# EAGLE design preparedinstruments_0_bechemel_v12_KEYPAD_JLC_READY (EAGLE 9.6.2)

## Sheet 1 of 2
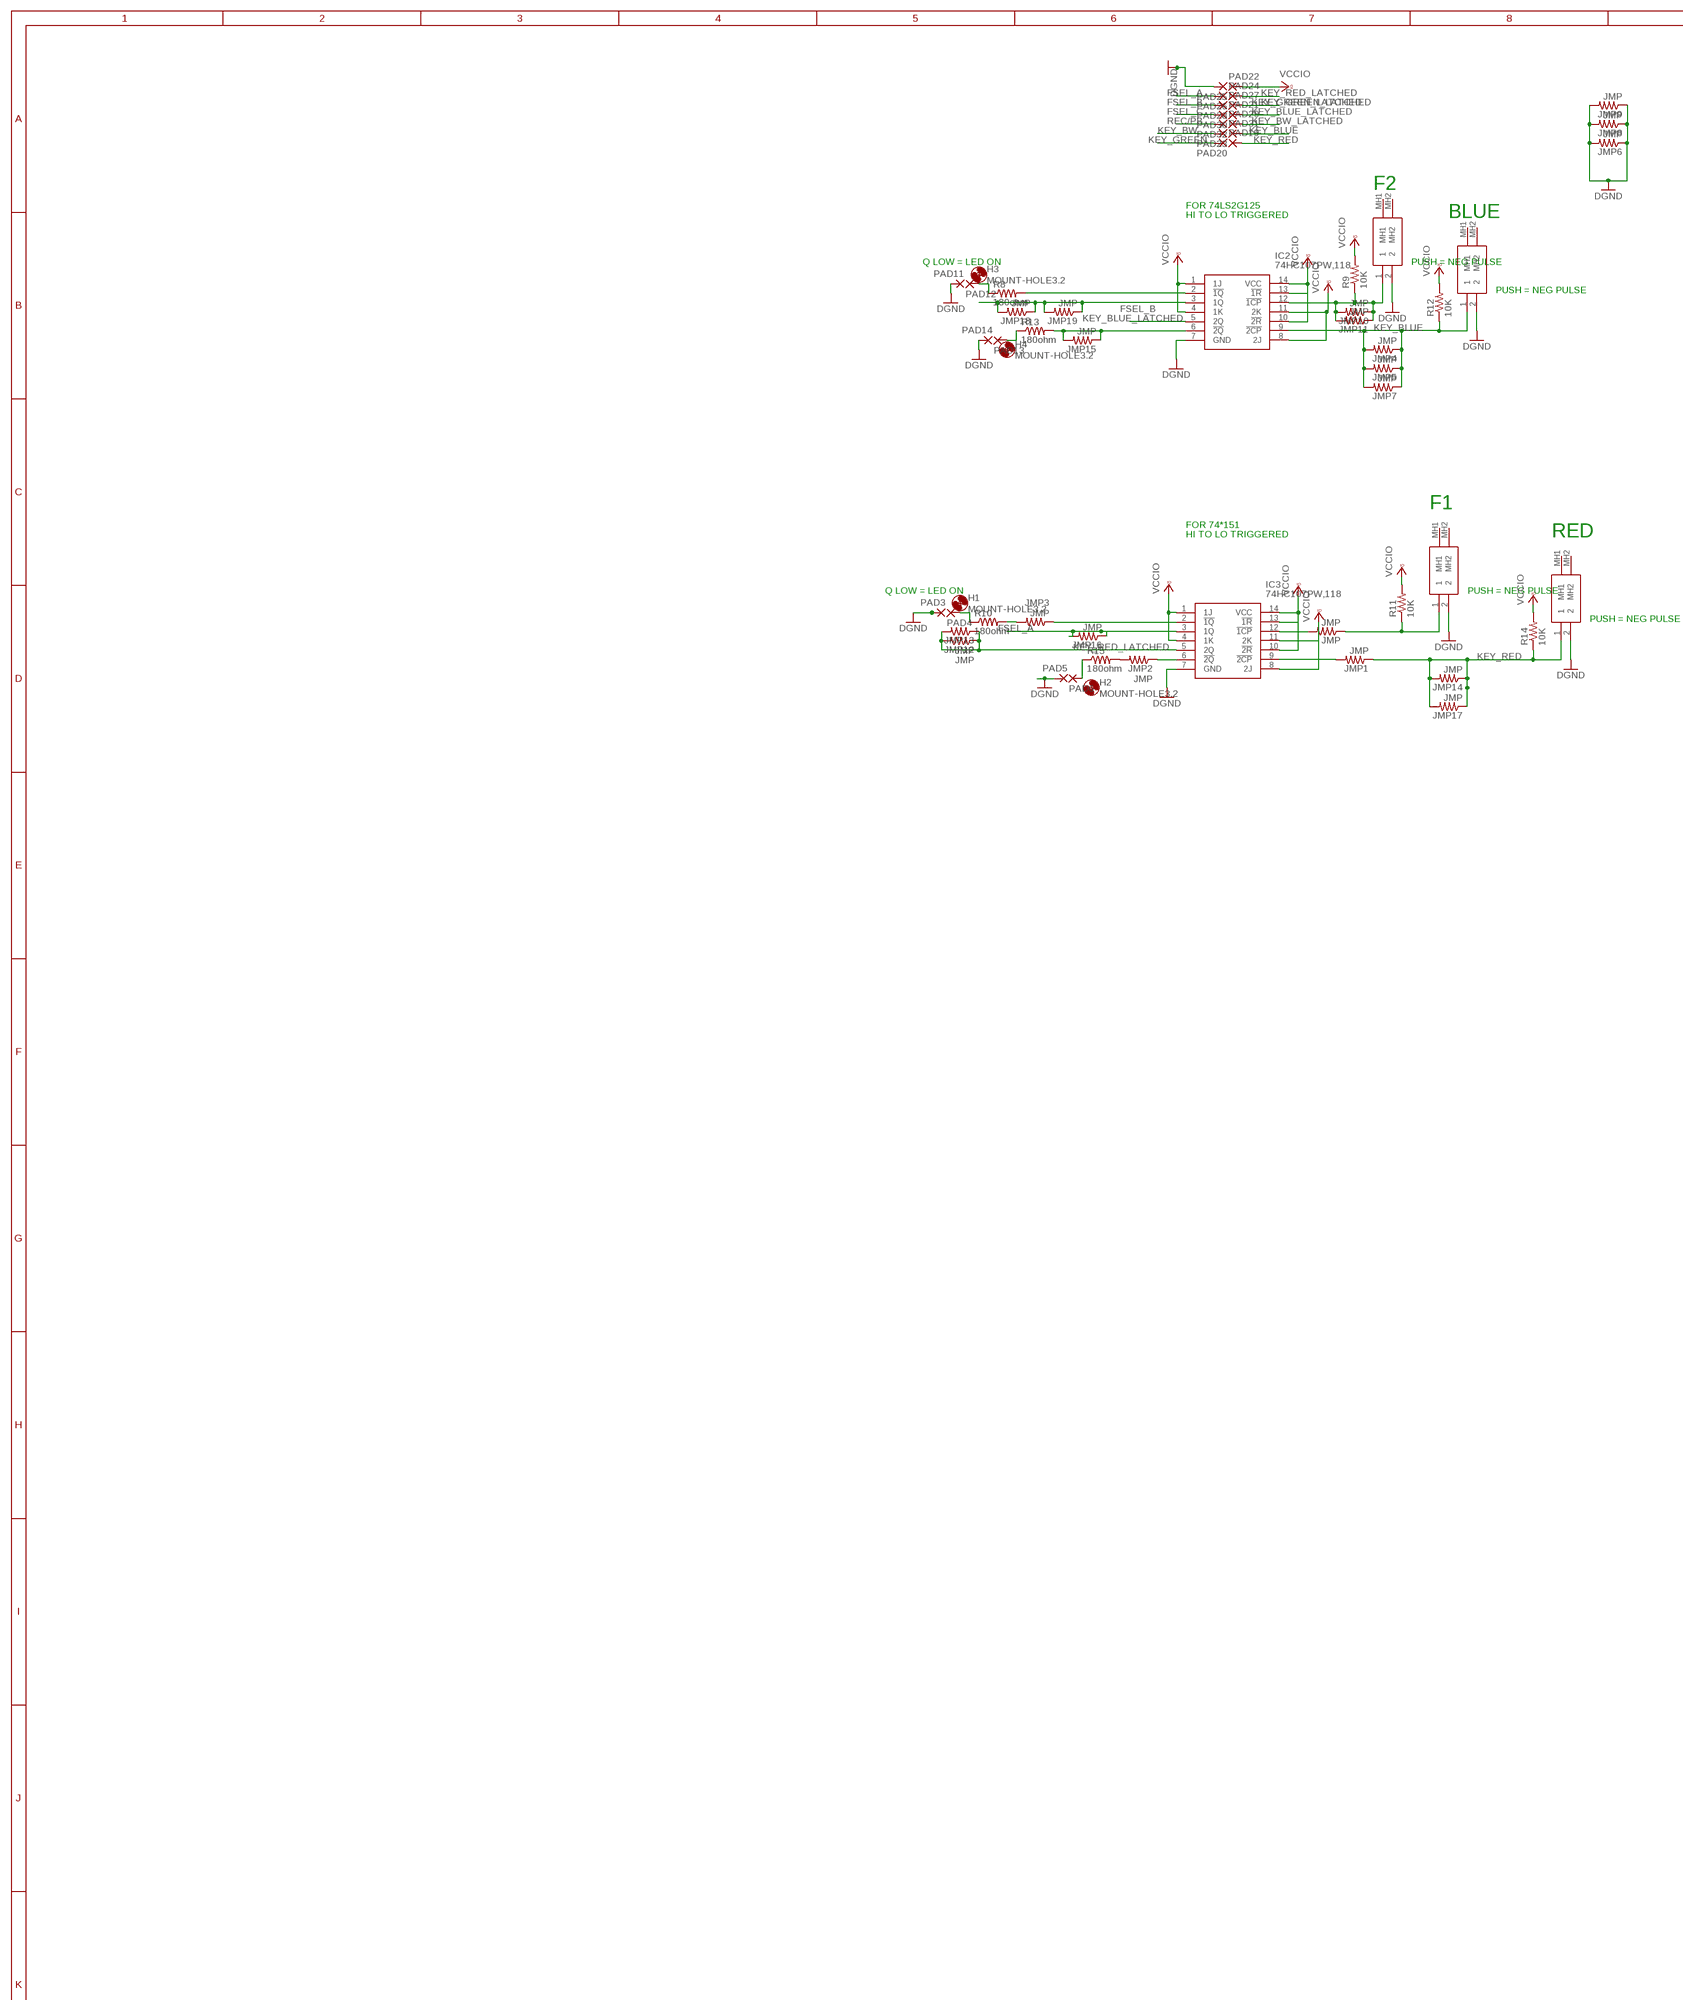
[diagram p0: schematic, sheet 1, part 1 of 3]
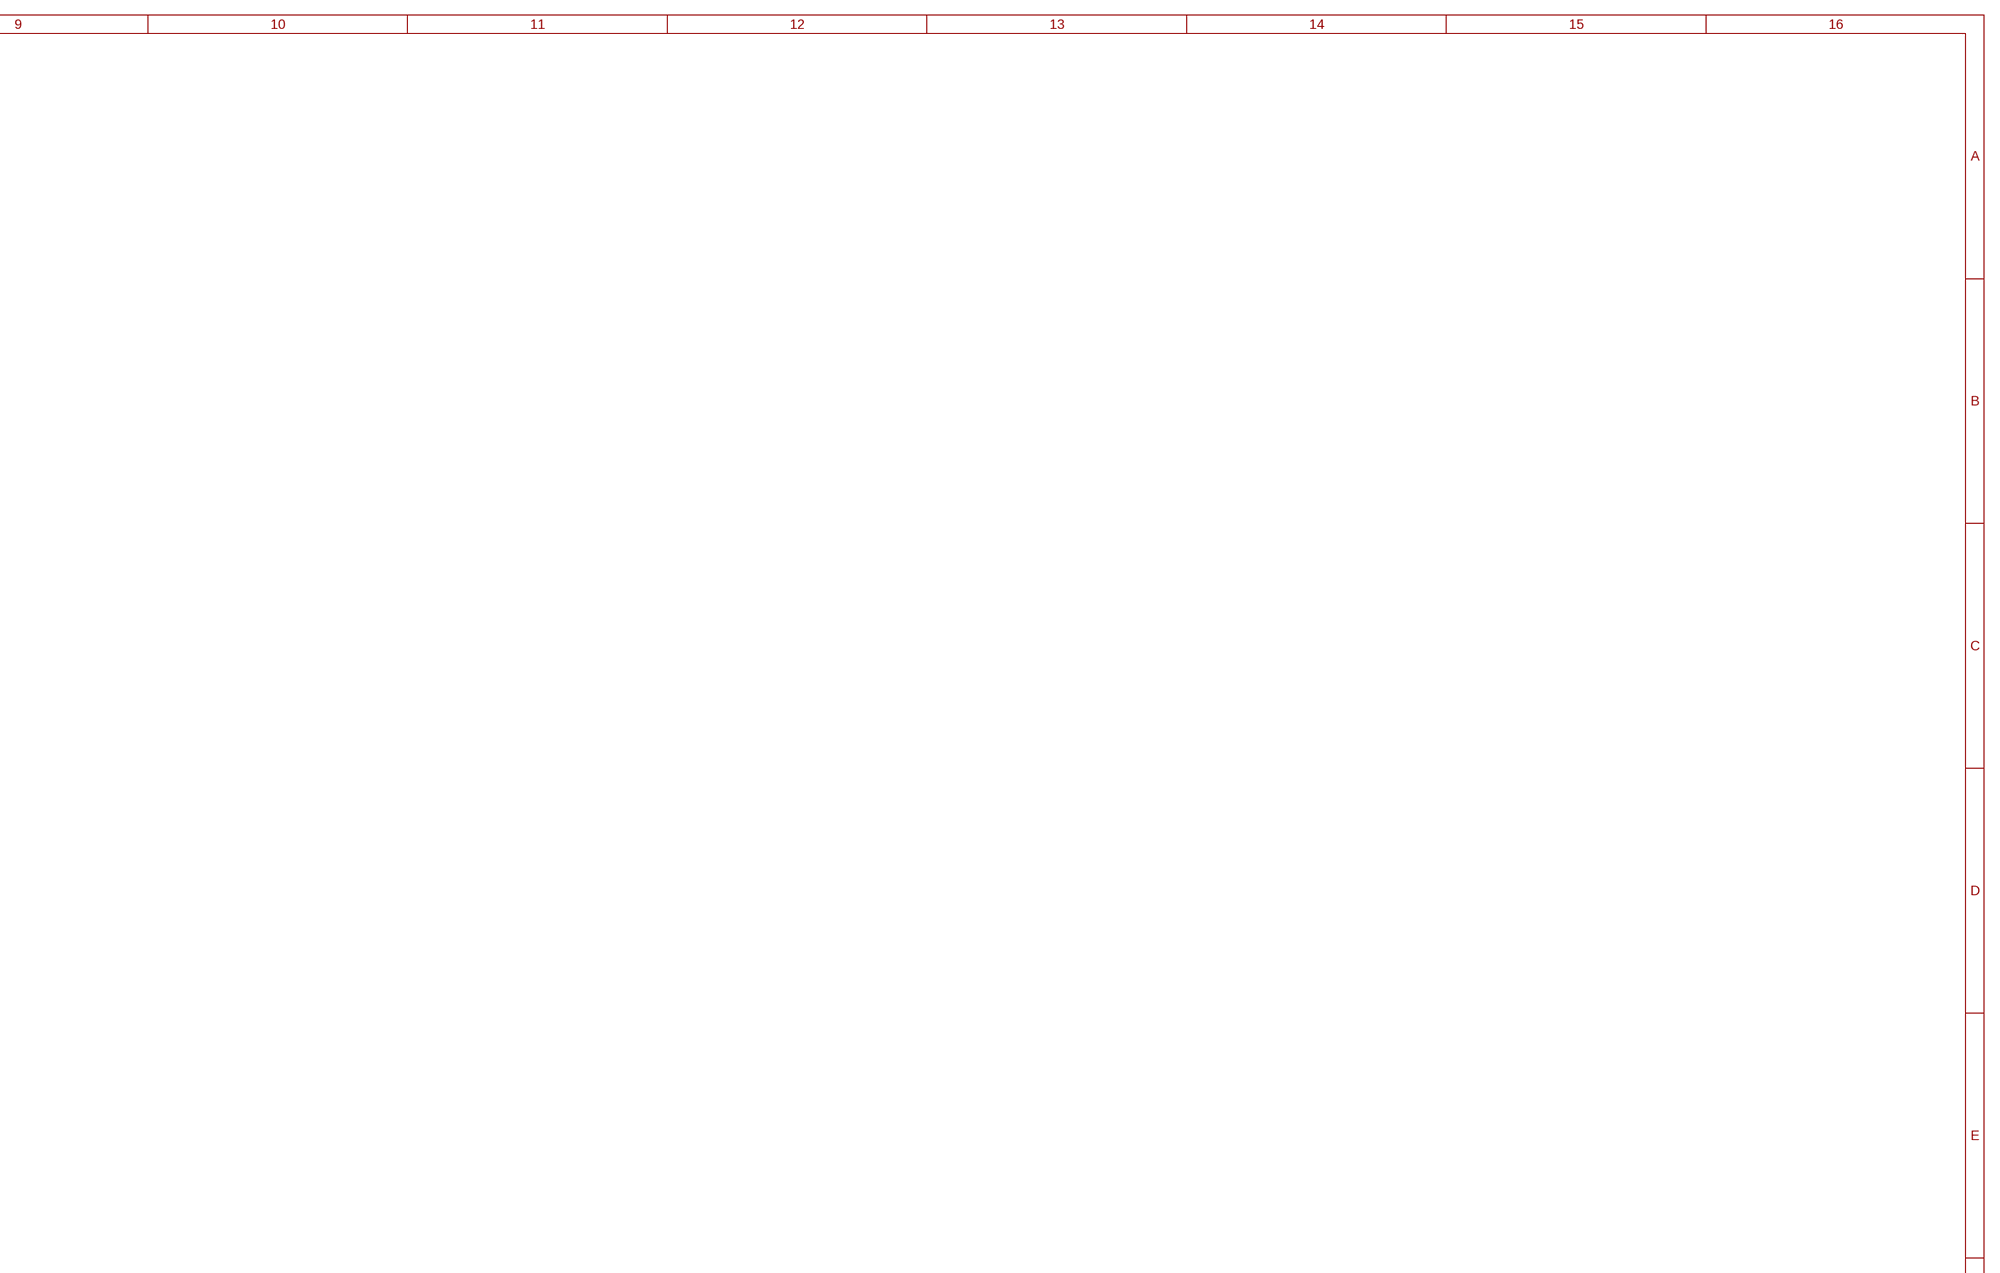
[diagram p1: schematic, sheet 1, part 2 of 3]
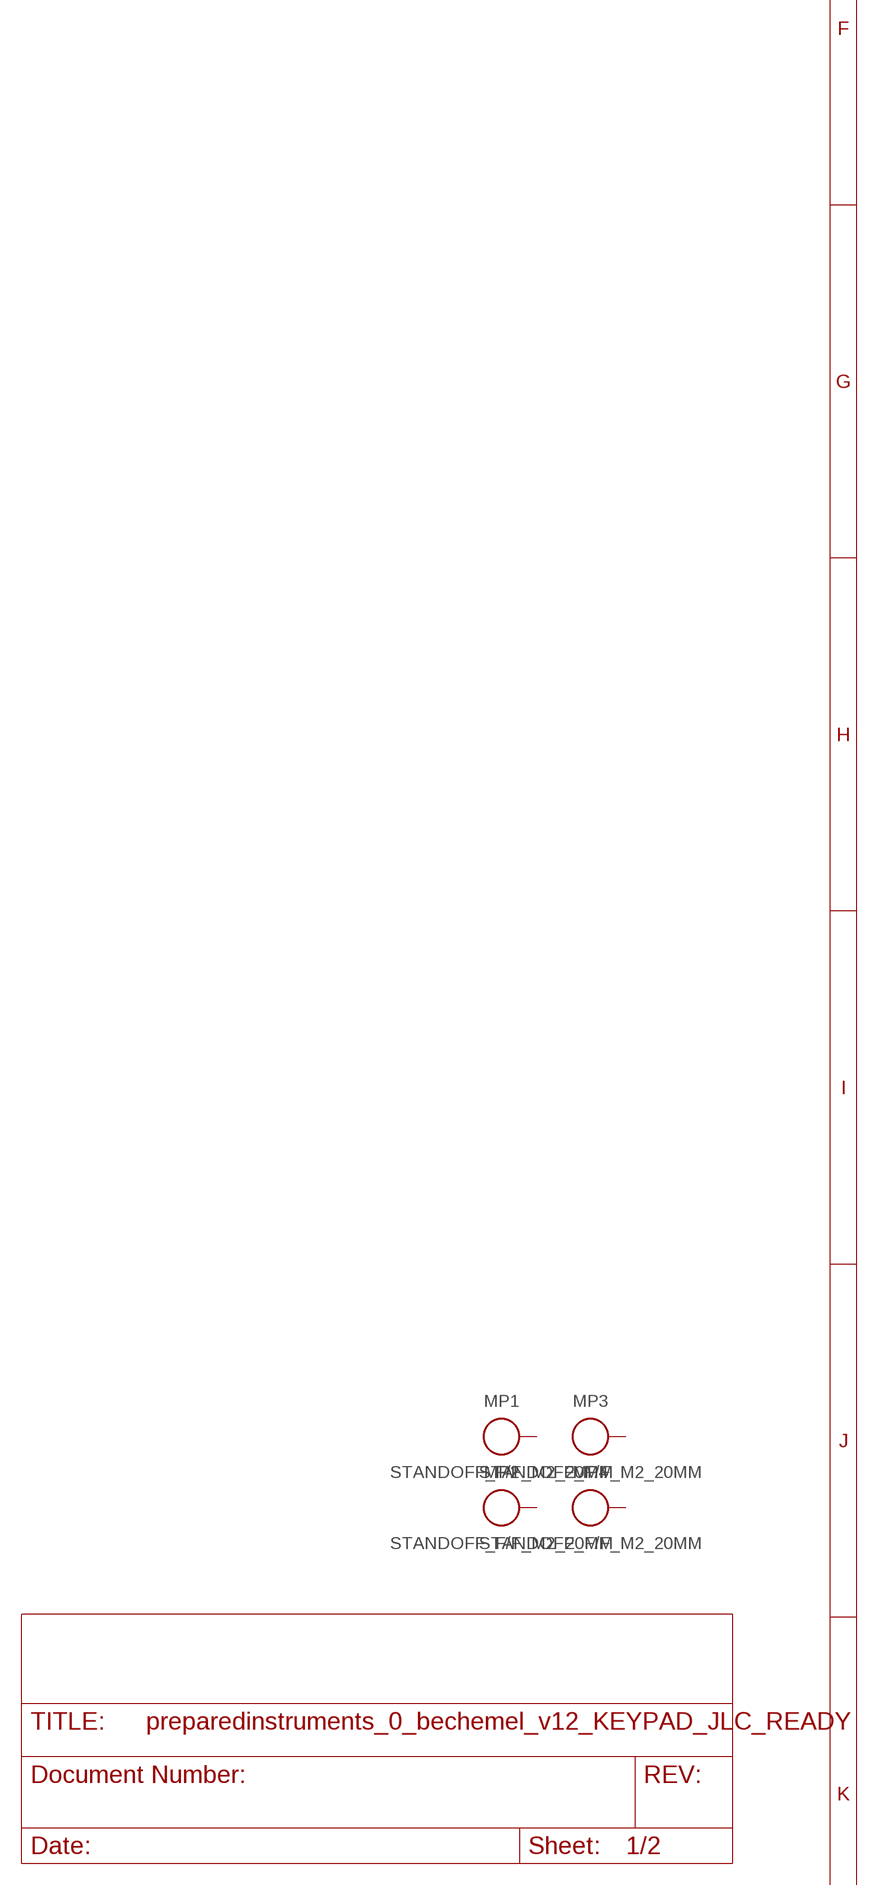
[diagram p2: schematic, sheet 1, part 3 of 3]

### Parts
H1  MOUNT-HOLE3.2  [3,2]
H2  MOUNT-HOLE3.2  [3,2]
H3  MOUNT-HOLE3.2  [3,2]
H4  MOUNT-HOLE3.2  [3,2]
IC2  74HC107PW,118  [SOP65P640X110-14N]
IC3  74HC107PW,118  [SOP65P640X110-14N]
JMP  JMP  R-US_R0805  [R0805]
JMP1  JMP  R-US_R0805  [R0805]
JMP2  JMP  R-US_R0805  [R0805]
JMP3  JMP  R-US_R0805  [R0805]
JMP4  JMP  R-US_R0805  [R0805]
JMP5  JMP  R-US_R0805  [R0805]
JMP6  JMP  R-US_R0805  [R0805]
JMP7  JMP  R-US_R0805  [R0805]
JMP8  JMP  R-US_R0805  [R0805]
JMP9  JMP  R-US_R0805  [R0805]
JMP10  JMP  R-US_R0805  [R0805]
JMP11  JMP  R-US_R0805  [R0805]
JMP12  JMP  R-US_R0805  [R0805]
JMP13  JMP  R-US_R0805  [R0805]
JMP14  JMP  R-US_R0805  [R0805]
JMP15  JMP  R-US_R0805  [R0805]
JMP16  JMP  R-US_R0805  [R0805]
JMP17  JMP  R-US_R0805  [R0805]
JMP18  JMP  R-US_R0805  [R0805]
JMP19  JMP  R-US_R0805  [R0805]
MP1  STANDOFF_F/F_M2_20MM  [STANDOFF_HEX_FEMALE_400X2000_M2X0.4_MTGP600H220]
MP2  STANDOFF_F/F_M2_20MM  [STANDOFF_HEX_FEMALE_400X2000_M2X0.4_MTGP600H220]
MP3  STANDOFF_F/F_M2_20MM  [STANDOFF_HEX_FEMALE_400X2000_M2X0.4_MTGP600H220]
MP4  STANDOFF_F/F_M2_20MM  [STANDOFF_HEX_FEMALE_400X2000_M2X0.4_MTGP600H220]
PAD3  SMD2  [SMD1,27-2,54]
PAD4  SMD2  [SMD1,27-2,54]
PAD5  SMD2  [SMD1,27-2,54]
PAD6  SMD2  [SMD1,27-2,54]
PAD11  SMD2  [SMD1,27-2,54]
PAD12  SMD2  [SMD1,27-2,54]
PAD13  SMD2  [SMD1,27-2,54]
PAD14  SMD2  [SMD1,27-2,54]
PAD19  SMD2  [SMD1,27-2,54]
PAD20  SMD2  [SMD1,27-2,54]
PAD21  SMD2  [SMD1,27-2,54]
PAD22  SMD2  [SMD1,27-2,54]
PAD23  SMD2  [SMD1,27-2,54]
PAD24  SMD2  [SMD1,27-2,54]
PAD25  SMD2  [SMD1,27-2,54]
PAD26  SMD2  [SMD1,27-2,54]
PAD27  SMD2  [SMD1,27-2,54]
PAD28  SMD2  [SMD1,27-2,54]
PAD29  SMD2  [SMD1,27-2,54]
PAD30  SMD2  [SMD1,27-2,54]
PAD31  SMD2  [SMD1,27-2,54]
PAD32  SMD2  [SMD1,27-2,54]
R8  180ohm  R-US_R0805  [R0805]
R9  10K  R-US_R0805  [R0805]
R10  180ohm  R-US_R0805  [R0805]
R11  10K  R-US_R0805  [R0805]
R12  10K  R-US_R0805  [R0805]
R13  180ohm  R-US_R0805  [R0805]
R14  10K  R-US_R0805  [R0805]
R15  180ohm  R-US_R0805  [R0805]
S6  MX1A-11NW  [MX1A11NW]
S7  MX1A-11NW  [MX1A11NW]
S8  MX1A-11NW  [MX1A11NW]
S9  MX1A-11NW  [MX1A11NW]

### Nets
DGND: IC2.7(GND) IC3.7(GND) JMP6.1 JMP6.2 JMP8.1 JMP8.2 JMP9.1 JMP9.2 PAD3.1(P) PAD5.1(P) PAD11.1(P) PAD14.1(P) PAD25.1(P) S6.2 S7.2 S8.2 S9.2 ; also sheet 2
FSEL_A: IC3.3(1Q) JMP16.1 JMP16.2 PAD26.1(P)
FSEL_B: IC2.3(1Q) JMP18.1 JMP18.2 JMP19.1 JMP19.2 PAD28.1(P)
FSEL_C: PAD30.1(P) ; also sheet 2
KEY_BLUE: IC2.9(!2CP) JMP4.1 JMP4.2 JMP5.1 JMP5.2 JMP7.1 JMP7.2 PAD31.1(P) R12.1 S8.1
KEY_BLUE_LATCHED: IC2.5(2Q) PAD21.1(P)
KEY_BW: PAD23.1(P) ; also sheet 2
KEY_BW_LATCHED: PAD29.1(P) ; also sheet 2
KEY_GREEN: PAD20.1(P) ; also sheet 2
KEY_GREEN_LATCHED: PAD27.1(P) ; also sheet 2
KEY_RED: JMP1.1 JMP14.1 JMP14.2 JMP17.1 JMP17.2 PAD19.1(P) R14.1 S9.1
KEY_RED_LATCHED: IC3.5(2Q) JMP12.1 JMP12.2 JMP13.1 JMP13.2 PAD24.1(P)
N$13: PAD12.1(P) R8.1
N$14: IC2.2(!1Q) R8.2
N$16: IC2.12(!1CP) JMP10.1 JMP10.2 JMP11.1 JMP11.2 R9.1 S6.1
N$17: PAD4.1(P) R10.1
N$18: JMP3.2 R10.2
N$20: IC3.12(!1CP) JMP.2
N$22: PAD13.1(P) R13.1
N$23: IC2.6(!2Q) JMP15.1 JMP15.2 R13.2
N$26: PAD6.1(P) R15.1
N$27: JMP2.2 R15.2
N$33: JMP.1 R11.1 S7.1
N$35: IC3.9(!2CP) JMP1.2
N$36: IC3.6(!2Q) JMP2.1
N$37: IC3.2(!1Q) JMP3.1
REC/PB: PAD32.1(P) ; also sheet 2
VCCIO: IC2.1(1J) IC2.4(1K) IC2.8(2J) IC2.10(!2R) IC2.11(2K) IC2.13(!1R) IC2.14(VCC) IC3.1(1J) IC3.4(1K) IC3.8(2J) IC3.10(!2R) IC3.11(2K) IC3.13(!1R) IC3.14(VCC) PAD22.1(P) R9.2 R11.2 R12.2 R14.2 ; also sheet 2
Unconnected: MP1.1 MP2.1 MP3.1 MP4.1 S6.MH1 S6.MH2 S7.MH1 S7.MH2 S8.MH1 S8.MH2 S9.MH1 S9.MH2

### Notes on the sheet
- F2
- FOR 74LS2G125
- HI TO LO TRIGGERED | BLUE
- Q LOW = LED ON | PUSH = NEG PULSE
- PUSH = NEG PULSE
- F1
- FOR 74*151
- HI TO LO TRIGGERED | RED
- Q LOW = LED ON | PUSH = NEG PULSE
- PUSH = NEG PULSE

## Sheet 2 of 2
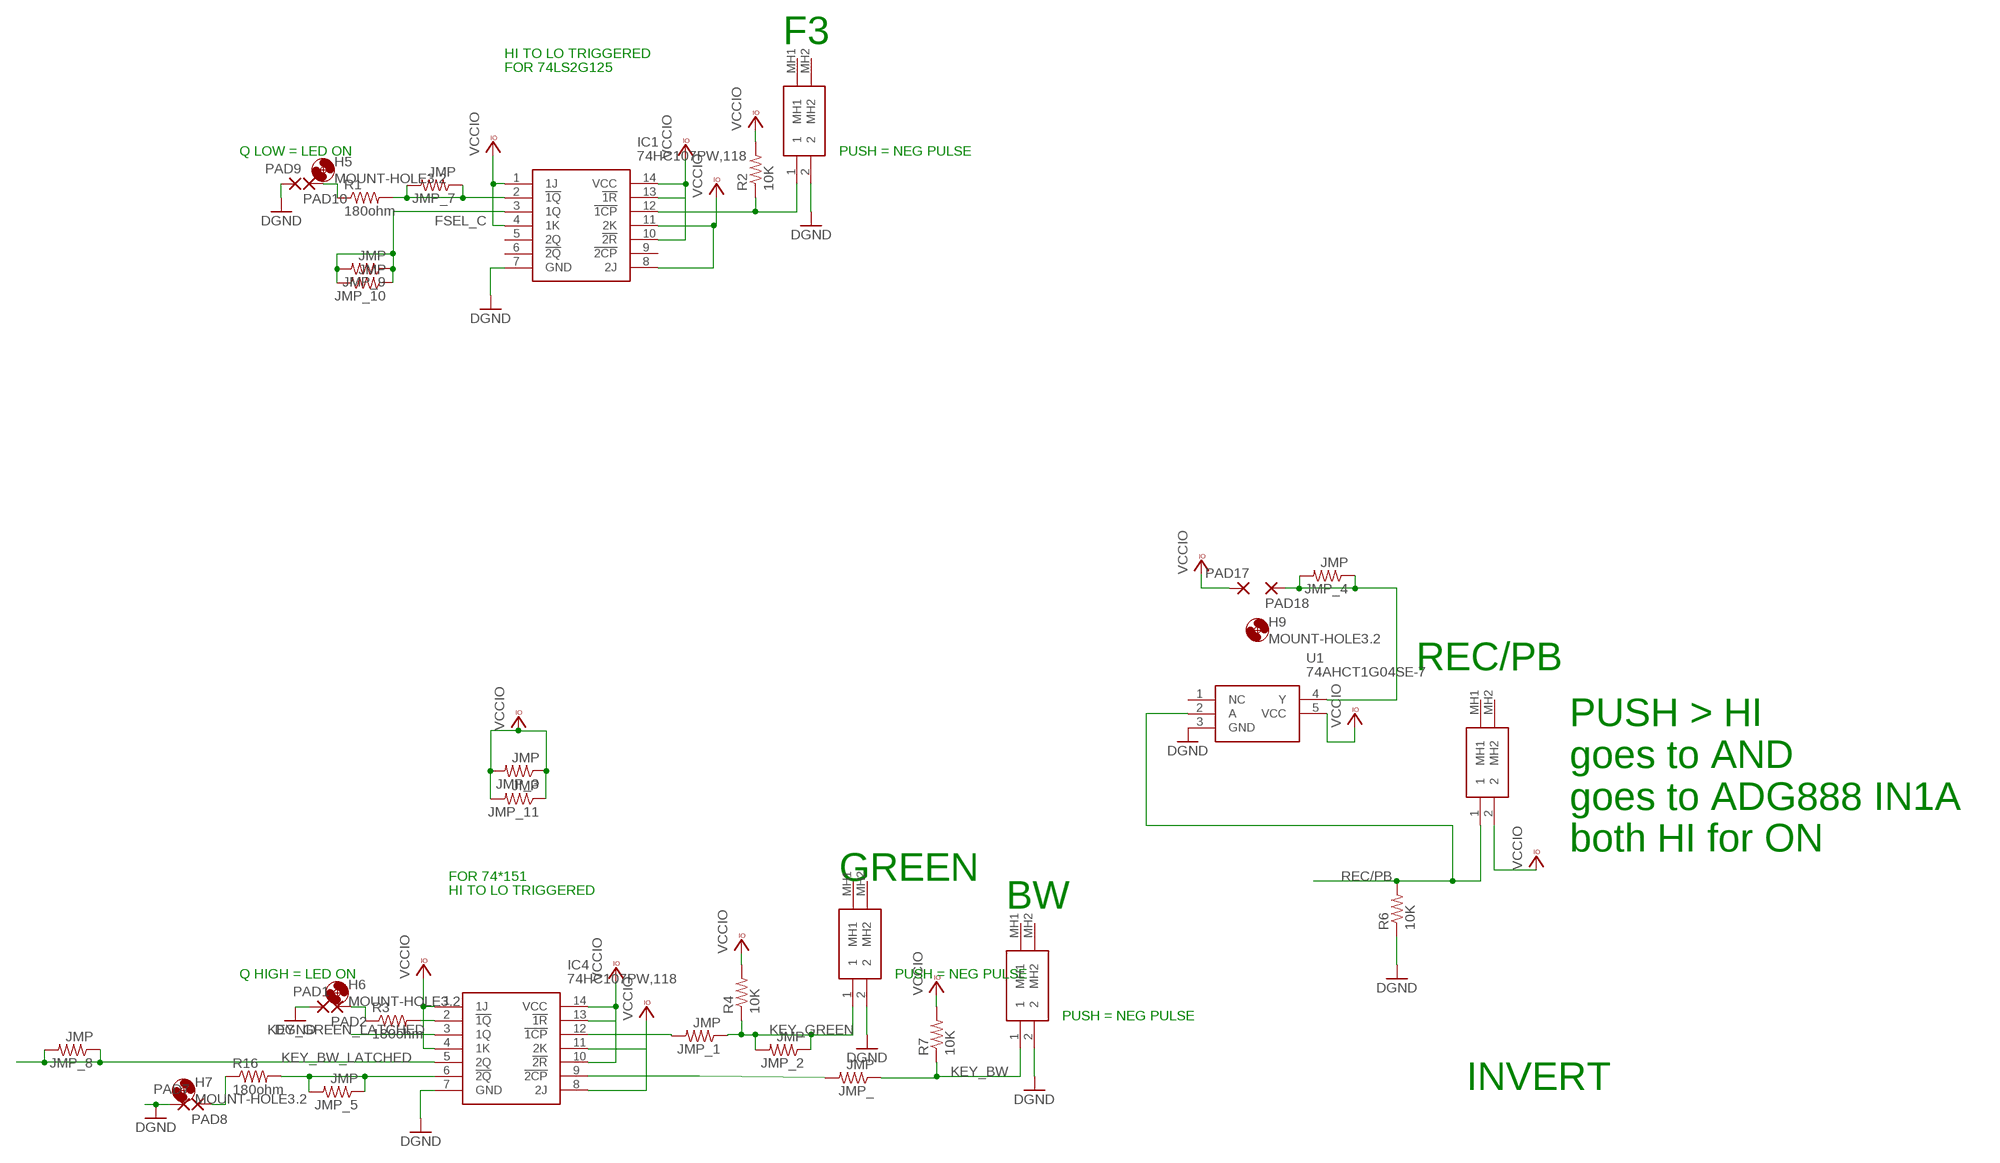
[diagram p3: schematic, sheet 2]

### Parts
H5  MOUNT-HOLE3.2  [3,2]
H6  MOUNT-HOLE3.2  [3,2]
H7  MOUNT-HOLE3.2  [3,2]
H9  MOUNT-HOLE3.2  [3,2]
IC1  74HC107PW,118  [SOP65P640X110-14N]
IC4  74HC107PW,118  [SOP65P640X110-14N]
JMP_  JMP  R-US_R0805  [R0805]
JMP_1  JMP  R-US_R0805  [R0805]
JMP_2  JMP  R-US_R0805  [R0805]
JMP_3  JMP  R-US_R0805  [R0805]
JMP_4  JMP  R-US_R0805  [R0805]
JMP_5  JMP  R-US_R0805  [R0805]
JMP_7  JMP  R-US_R0805  [R0805]
JMP_8  JMP  R-US_R0805  [R0805]
JMP_9  JMP  R-US_R0805  [R0805]
JMP_10  JMP  R-US_R0805  [R0805]
JMP_11  JMP  R-US_R0805  [R0805]
PAD1  SMD2  [SMD1,27-2,54]
PAD2  SMD2  [SMD1,27-2,54]
PAD7  SMD2  [SMD1,27-2,54]
PAD8  SMD2  [SMD1,27-2,54]
PAD9  SMD2  [SMD1,27-2,54]
PAD10  SMD2  [SMD1,27-2,54]
PAD17  SMD2  [SMD1,27-2,54]
PAD18  SMD2  [SMD1,27-2,54]
R1  180ohm  R-US_R0805  [R0805]
R2  10K  R-US_R0805  [R0805]
R3  180ohm  R-US_R0805  [R0805]
R4  10K  R-US_R0805  [R0805]
R6  10K  R-US_R0805  [R0805]
R7  10K  R-US_R0805  [R0805]
R16  180ohm  R-US_R0805  [R0805]
S1  MX1A-11NW  [MX1A11NW]
S2  MX1A-11NW  [MX1A11NW]
S4  MX1A-11NW  [MX1A11NW]
S5  MX1A-11NW  [MX1A11NW]
U1  74AHCT1G04SE-7  [SOT65P210X110-5N]

### Nets
DGND: IC1.7(GND) IC4.7(GND) PAD1.1(P) PAD7.1(P) PAD9.1(P) R6.1 S1.2 S2.2 S4.2 U1.3(GND) ; also sheet 1
FSEL_C: IC1.3(1Q) JMP_9.1 JMP_9.2 JMP_10.1 JMP_10.2 ; also sheet 1
KEY_BW: JMP_.1 R7.1 S4.1 ; also sheet 1
KEY_BW_LATCHED: IC4.5(2Q) JMP_8.1 JMP_8.2 ; also sheet 1
KEY_GREEN: JMP_1.1 JMP_2.1 JMP_2.2 R4.1 S2.1 ; also sheet 1
KEY_GREEN_LATCHED: IC4.3(1Q) ; also sheet 1
N$1: PAD10.1(P) R1.1
N$2: IC1.2(!1Q) JMP_7.1 JMP_7.2 R1.2
N$3: JMP_4.1 JMP_4.2 PAD18.1(P) U1.4(Y)
N$4: IC1.12(!1CP) R2.1 S1.1
N$5: PAD2.1(P) R3.1
N$6: IC4.2(!1Q) R3.2
N$30: PAD8.1(P) R16.1
N$31: IC4.6(!2Q) JMP_5.1 JMP_5.2 R16.2
N$34: IC4.9(!2CP) JMP_.2
N$39: IC4.12(!1CP) JMP_1.2
REC/PB: R6.2 S5.1 U1.2(A) ; also sheet 1
VCCIO: IC1.1(1J) IC1.4(1K) IC1.8(2J) IC1.10(!2R) IC1.11(2K) IC1.13(!1R) IC1.14(VCC) IC4.1(1J) IC4.4(1K) IC4.8(2J) IC4.10(!2R) IC4.11(2K) IC4.13(!1R) IC4.14(VCC) JMP_3.1 JMP_3.2 JMP_11.1 JMP_11.2 PAD17.1(P) R2.2 R4.2 R7.2 S5.2 U1.5(VCC) ; also sheet 1
Unconnected: IC1.5(2Q) IC1.6(!2Q) IC1.9(!2CP) S1.MH1 S1.MH2 S2.MH1 S2.MH2 S4.MH1 S4.MH2 S5.MH1 S5.MH2 U1.1(NC)

### Notes on the sheet
- F3
- HI TO LO TRIGGERED
- FOR 74LS2G125
- Q LOW = LED ON | PUSH = NEG PULSE
- REC/PB
- PUSH > HI
  goes to AND 
  goes to ADG888 IN1A
  both HI for ON
- FOR 74*151 | GREEN
- HI TO LO TRIGGERED
- BW
- Q HIGH = LED ON | PUSH = NEG PULSE
- PUSH = NEG PULSE
- INVERT

## Library data of the parts
H1-H7 H9 = holes:MOUNT-HOLE: MOUNTING HOLE with drill center marker
IC1-IC4 = 74HC107PW_118:74HC107PW,118: 74HC(T)107 - Dual JK flip-flop with reset; negative-edge trigger@en-us Source: Datasheet <https://assets.nexperia.com/documents/data-sheet/74HC_HCT107.pdf>; DESCRIPTION: 74HC(T)107 - Dual JK flip-flop with reset; negative-edge trigger@en-us; HEIGHT: 1.1mm; MANUFACTURER_NAME: Nexperia; MANUFACTURER_PART_NUMBER: 74HC107PW,118; MOUSER_PART_NUMBER: 771-HC107PW118; MOUSER_PRICE-STOCK: https://www.mouser.co.uk/ProductDetail/Nexperia/74HC107PW118?qs=P62ublwmbi8k2l1WkAc68Q%3D%3D
JMP JMP1-JMP19 JMP_ JMP_1-JMP_5 JMP_7-JMP_11 R1-R4 R6-R16 = adafruit:R-US_: RESISTOR, American symbol
MP1-MP4 = PCB-Fasteners_Hardware:STANDOFF_F/F: Female-Female Standoff/Spacer with Mounting pad and hole. Essentra : Female Standoff <https://www.essentracomponents.co.in/index.php?option=com_virtuemart&view=productdetails&virtuemart_product_id=14493> The hole and pad sizes may vary based on the application and type of hardware; always verify the Manufacturer specification or Global Standards.; CATEGORY: Standoff/Spacer; SUB-CATEGORY: Female-Female
PAD1-PAD14 PAD17-PAD32 = wirepad:SMD2: SMD PAD
S1 S2 S4-S9 = MX1A-11NW:MX1A-11NW: CHERRY - MX1A-11NW - Tactile Switch, MX Series, Top Actuated, Surface Mount, Plunger for Cap, 59.5 gf, 10mA at 12VDC Source: Datasheet <https://media.digikey.com/pdf/Data Sheets/Cherry PDFs/MX Series.pdf>; DESCRIPTION: CHERRY - MX1A-11NW - Tactile Switch, MX Series, Top Actuated, Surface Mount, Plunger for Cap, 59.5 gf, 10mA at 12VDC; HEIGHT: 15.2mm; MANUFACTURER_NAME: Cherry; MANUFACTURER_PART_NUMBER: MX1A-11NW; MOUSER_PART_NUMBER: 540-MX1A-11NW; MOUSER_PRICE-STOCK: https://www.mouser.co.uk/ProductDetail/CHERRY/MX1A-11NW?qs=5iusCjFLgR7487Rvpe7dvw%3D%3D
U1 = 74AHCT1G04SE-7:74AHCT1G04SE-7: DiodesZetex 74AHCT1G04SE-7 Inverter, Totem Pole, 4.5 5.5 V, 5-Pin SOT-353 Source: Datasheet <https://componentsearchengine.com/Datasheets/2/74AHCT1G04SE-7.pdf>; DESCRIPTION: DiodesZetex 74AHCT1G04SE-7 Inverter, Totem Pole, 4.5 5.5 V, 5-Pin SOT-353; HEIGHT: 1.1mm; MANUFACTURER_NAME: Diodes Inc.; MANUFACTURER_PART_NUMBER: 74AHCT1G04SE-7; MOUSER_PART_NUMBER: 621-74AHCT1G04SE-7; MOUSER_PRICE-STOCK: https://www.mouser.co.uk/ProductDetail/Diodes-Incorporated/74AHCT1G04SE-7?qs=MKoP7Oyr0W46emPhmpXrVg%3D%3D

## Board
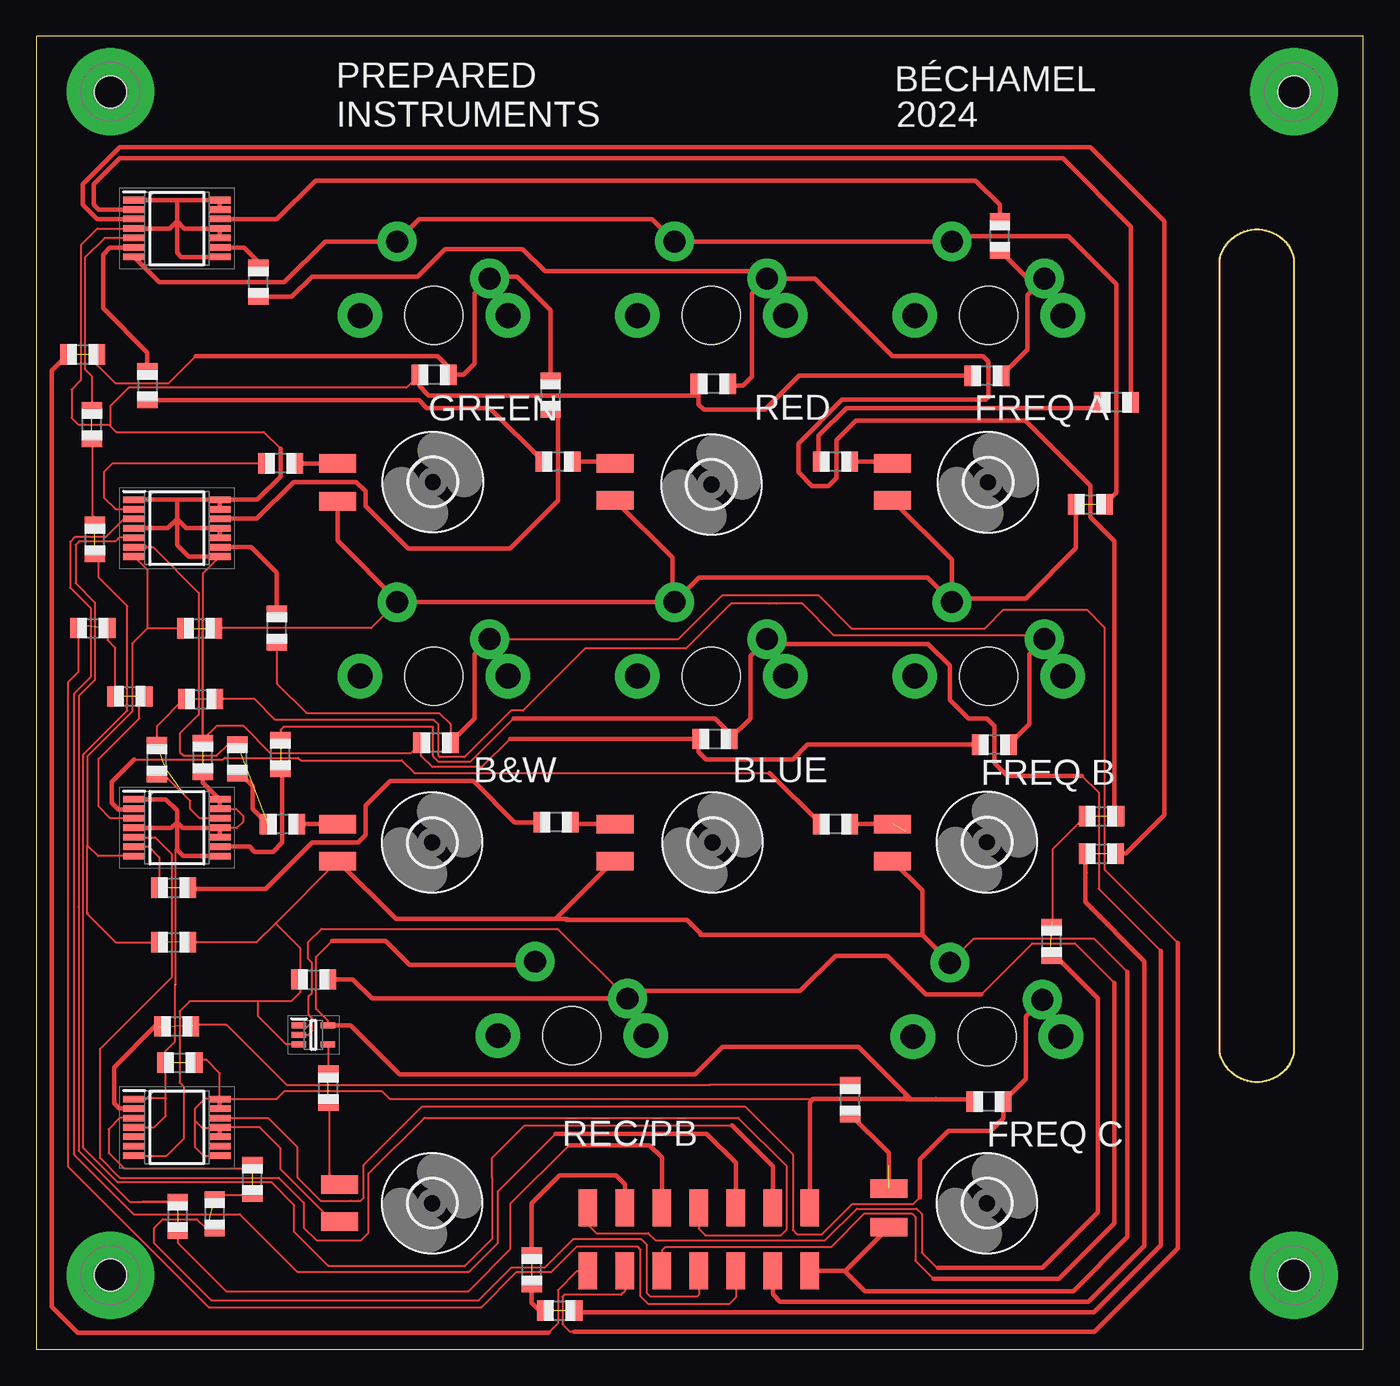
[diagram p4: board, top side]
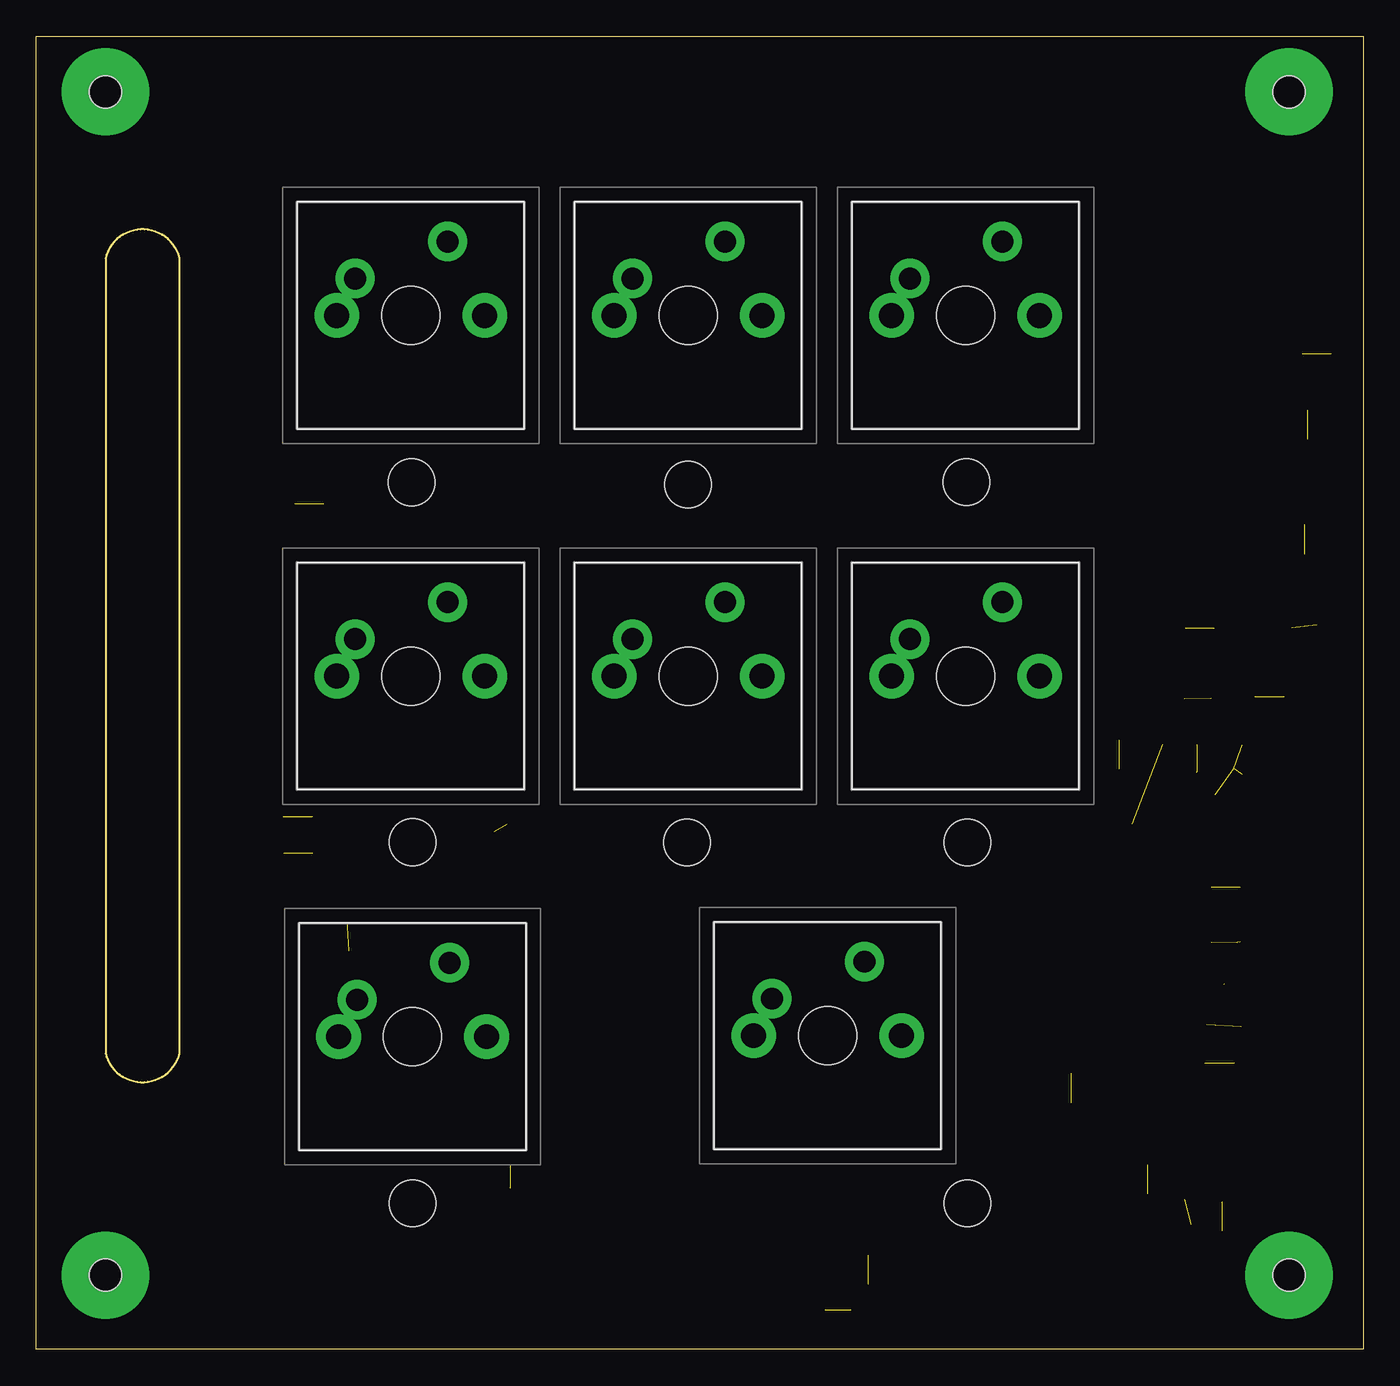
[diagram p5: board, bottom side, seen from below]

Size 91.11 x 90.16 mm. Coordinates in mm from the lower left corner, seen from the top.
Outline: 0,0 91.11,0 91.11,90.16 0,90.16 0,0
Outline: 86.36,74.93 86.36,20.32 arc-152 81.28,20.32 81.28,74.93 arc-152 86.36,74.93
Copper layers (1*16): Top 0.035mm / dielectric 1.6mm / Bottom 0.035mm
Design rules "jlcpcb-2layers": minimum track width 5mil, minimum drill 0.3mm, track to track 5mil, track to pad 5mil, pad to pad 5mil, via to via 5mil, smd to smd 5mil, copper to edge 0.2mm, drill to drill 6mil, minimum pad ring 10mil, minimum via ring 3mil, stop-mask expansion 4mil, vias tented up to drill 0mil, thermal gap 10mil

### Footprints (pad centres in the part's own frame; a part is rotated, then mirrored left to right if it is on the bottom)
3,2 = hole 3.2: 0,0
SOP65P640X110-14N = smd 1.475 x 0.45: 1 -2.938,1.95; 2 -2.938,1.3; 3 -2.938,0.65; 4 -2.938,0; 5 -2.938,-0.65; 6 -2.938,-1.3; 7 -2.938,-1.95; 8 2.938,-1.95; 9 2.938,-1.3; 10 2.938,-0.65; 11 2.938,0; 12 2.938,0.65; 13 2.938,1.3; 14 2.938,1.95
R0805 = smd 1.1 x 1.4: 1 -1,0; 2 1,0
STANDOFF_HEX_FEMALE_400X2000_M2X0.4_MTGP600H220 = drill 2.2 pad 6: 1 0,0 | hole 2.2: 0,0
SMD1,27-2,54 = smd 1.27 x 2.54: 1 0,0
MX1A11NW = drill 1.499 pad 2.248: 1 0,0; 2 6.35,2.54 | drill 1.702 pad 2.553: MH1 -1.27,-2.54; MH2 8.89,-2.54 | hole 3.988: 3.81,-2.54
SOT65P210X110-5N = smd 1 x 0.4: 1 -1,0.65; 2 -1,0; 3 -1,-0.65; 4 1,-0.65; 5 1,0.65

### Placement (x,y rotation side)
H1  65.28,34.82 0 top
H2  46.43,34.8 0 top
H3  46.36,59.39 0 top
H4  65.35,59.54 0 top
H5  27.18,34.8 0 top
H6  27.23,59.56 0 top
H7  65.28,10.03 0 top
H9  27.18,10.03 0 top
IC1  9.65,15.24 0 top
IC2  9.65,35.81 0 top
IC3  9.65,76.96 0 top
IC4  9.65,56.39 0 top
JMP  66.17,76.45 90 top
JMP1  15.24,73.28 90 top
JMP2  7.62,66.17 270 top
JMP3  74.17,65.02 180 top
JMP4  34.01,5.46 90 top
JMP5  35.94,2.67 0 top
JMP6  72.39,58.04 0 top
JMP7  16.76,40.84 90 top
JMP8  11.2,49.5 0 top
JMP9  9.42,27.97 0 top
JMP10  8.28,40.49 90 top
JMP11  11.28,44.65 0 top
JMP12  3.81,63.5 90 top
JMP13  4.01,55.63 90 top
JMP14  73.15,36.6 0 top
JMP15  9.42,31.7 0 top
JMP16  73.13,34.04 0 top
JMP17  69.72,28.02 90 top
JMP18  6.43,44.83 0 top
JMP19  3.89,49.53 0 top
JMP_  16.51,49.53 90 top
JMP_1  35.31,65.53 270 top
JMP_2  3.17,68.33 0 top
JMP_3  11.43,40.64 90 top
JMP_4  20.04,17.93 90 top
JMP_5  13.79,40.54 90 top
JMP_7  9.63,22.17 0 top
JMP_8  9.7,9.12 90 top
JMP_9  12.24,9.3 90 top
JMP_10  14.83,11.66 90 top
JMP_11  9.86,19.68 0 top
MP1  86.36,5.08 0 top
MP2  86.36,86.36 0 top
MP3  5.08,5.08 0 top
MP4  5.08,86.36 0 top
PAD1  20.68,58.22 90 top
PAD2  20.7,60.83 90 top
PAD3  39.75,33.53 90 top
PAD4  58.8,60.83 90 top
PAD5  58.8,33.53 90 top
PAD6  39.75,60.83 90 top
PAD7  58.55,8.38 90 top
PAD8  20.7,36.07 90 top
PAD9  20.7,33.53 90 top
PAD10  58.55,11.05 90 top
PAD11  39.75,58.29 90 top
PAD12  58.8,36.07 90 top
PAD13  39.75,36.07 90 top
PAD14  58.8,58.29 90 top
PAD17  20.83,8.76 90 top
PAD18  20.83,11.3 90 top
PAD19  37.87,9.7 180 top
PAD20  37.87,5.38 180 top
PAD21  45.49,9.7 180 top
PAD22  53.11,9.7 180 top
PAD23  40.41,5.38 180 top
PAD24  50.57,9.7 180 top
PAD25  53.11,5.38 180 top
PAD26  50.57,5.38 180 top
PAD27  48.03,9.7 180 top
PAD28  48.03,5.38 180 top
PAD29  42.95,9.7 180 top
PAD30  45.49,5.38 180 top
PAD31  40.41,9.7 180 top
PAD32  42.95,5.38 180 top
R1  55.88,17.14 90 top
R2  65.41,17.02 180 top
R3  16.76,60.83 180 top
R4  27.3,66.93 180 top
R6  19.05,25.4 0 top
R7  27.43,41.66 180 top
R8  54.86,36.07 180 top
R9  65.79,41.53 180 top
R10  54.86,60.96 180 top
R11  65.28,66.85 180 top
R12  46.61,41.91 180 top
R13  35.69,36.2 180 top
R14  46.48,66.29 180 top
R15  35.81,60.96 180 top
R16  16.89,36.07 180 top
S1  69.09,24 0 bottom
S2  31.11,73.53 0 bottom
S4  31.11,48.77 0 bottom
S5  40.59,24.08 0 bottom
S6  69.21,48.77 0 bottom
S7  69.21,73.53 0 bottom
S8  50.17,48.77 0 bottom
S9  50.17,73.53 0 bottom
U1  19.02,21.59 0 top

### Tracks (layer width: path | path; a pad name or v marks a point on that pad's centre or on a via)
DGND  (4 unrouted)
  Top 0.152: S1.2 64.36,28.17 72.67,28.17 74.93,25.91 | IC2.7 4.24,33.86 3.5,34.6 | 3.53,29.95 3.5,29.97 | 3.5,29.97 3.5,29.9 5.46,27.94 8.64,27.94 | 3.5,29.97 3.5,34.6 | S4.2 22.99,49.53 12.7,49.53 12.67,49.51 JMP8.2 | PAD9.1 16.42,29.25 | 16.42,29.25 15.14,27.96 JMP9.2 | 16.42,29.25 18.11,27.56 18.11,25.4 18.11,24.51 17.5,23.9 15.24,23.9 | 15.24,23.9 10.52,23.9 9.83,23.22 9.83,18.31 10.13,18.01 10.13,14.48 8.95,13.29 IC1.7 | JMP8.1 7.62,49.51 | 7.62,49.51 6.58,48.46 6.58,43.79 3.5,40.72 3.5,34.6 | IC4.7 7.62,53.53 7.62,49.51 | U1.3 17.16,20.94 15.24,22.86 15.24,23.9
  Top 0.305: 43.69,51.31 S4.2 24.77,51.44 20.68,55.52 PAD1.1 | 43.69,51.31 S8.2 45.49,52.98 61.19,52.98 S6.2 62.87,51.56 | 60.83,28.45 45.72,28.45 | 45.72,28.45 45.59,28.45 | 60.83,28.45 S1.2 | PAD11.1 43.69,54.36 43.69,51.31 | PAD14.1 62.87,54.23 62.87,51.56 | 62.87,51.56 67.94,51.56 71.39,55.01 JMP6.1 | PAD9.1 24.69,29.54 35.64,29.54 | 35.64,29.54 36.43,29.54 36.38,29.49 44.68,29.49 45.72,28.45 | IC3.7 8.45,73.28 17.02,73.28 19.81,76.07 S2.2 26.29,77.6 42.29,77.6 S9.2 S7.2 63.25,76.45 70.87,76.45 74.17,73.15 74.17,58.82 JMP6.2 | 55.5,5.38 56.9,3.99 71.2,3.99 74.93,7.72 74.93,25.91 | R6.1 18.11,25.4 | PAD3.1 39.63,33.53 35.64,29.54 | PAD5.1 60.83,31.5 60.83,28.45 | PAD7.1 55.55,5.38 55.5,5.38 | 55.5,5.38 PAD25.1
FSEL_A  (1 unrouted)
  Top 0.152: 72.07,32.7 72.07,33.98 72.12,34.03 JMP16.1
  Top 0.305: PAD26.1 50.57,3.76 51.08,3.25 72.24,3.25 76.1,7.11 76.1,26.64 72.03,30.71 72.03,34.11 72.12,34.03 | 72.07,32.7 72.06,32.72 | IC3.3 4.18,77.61 3.17,78.61 3.17,80.01 5.71,82.55 72.39,82.55 77.47,77.47 77.47,36.7 74.8,34.04 JMP16.2
FSEL_B  (2 unrouted)
  Top 0.152: IC2.3 5.08,36.46 4.27,37.28 4.27,40.54 7.06,43.33 7.06,44.83 JMP18.2 | PAD28.1 48.03,3.58 47.55,3.1 42.05,3.1 41.5,3.64 41.5,6.85 41.32,7.04 37.09,7.04 35.33,5.28 32.94,5.28 30.56,2.9 11.84,2.9 2.16,12.57 2.16,45.8 2.89,46.52 JMP19.1 2.89,49.44 | JMP18.1 5.43,48.15 | 5.43,48.15 5.43,48.17 4.9,48.69 | 2.89,49.44 3.17,49.73 | 2.89,49.44 2.76,49.31 | 5.43,48.15 4.89,48.69 JMP19.2
FSEL_C  (2 unrouted)
  Top 0.152: PAD30.1 45.49,3.73 45.36,3.61 42.19,3.61 41.94,3.86 41.94,7.16 41.55,7.54 36.86,7.54 34.93,5.61 32.64,5.61 30.38,3.35 12.01,3.35 8.08,7.29 8.08,8.33 8.69,8.94 11.02,8.94 11.67,8.3 JMP_9.1 12.3,8.36 | IC1.3 5.73,15.89 4.95,15.11 4.95,13.49 6.02,12.42 11.79,12.42 14.6,12.42 JMP_10.2 | 11.81,8.59 12.04,8.36 12.3,8.36 | JMP_10.1 14.79,10.61 12.56,10.61 JMP_9.2 | 12.3,8.36 12.5,8.36
KEY_BLUE  (5 unrouted)
  Top 0.152: 71.81,39.37 72.95,38.23 72.95,31.62 77.22,27.36 | 32.77,43.31 29.79,40.34 27.63,40.34 27.25,40.72 27.25,42.72 27.23,42.75 16.97,42.75 16.76,42.55 JMP7.2
  Top 0.305: 71.81,39.37 66.67,39.37 65.79,40.26 65.79,42.8 65.28,43.31 64.01,43.31 62.74,44.58 62.74,46.94 61.24,48.44 50.5,48.44 S8.1 49.02,47.62 49.02,43.32 R12.1 47.61,42.31 46.61,43.31 32.77,43.31 | 77.22,27.36 77.22,7.13 72.62,2.54 36.96,2.54 36.96,2.65 JMP5.2 | PAD31.1 40.41,11.33 39.8,11.94 35.94,11.94 34.01,10.01 34.01,6.32 | JMP4.1 34.01,3.17 34.52,2.67 JMP5.1 35.18,2.67 | IC2.9 14.63,34.51 14.99,34.16 16.26,34.16 16.89,34.8 16.89,39.88 16.76,40.01
KEY_BLUE_LATCHED
  Top 0.152: IC2.5 8.14,35.16 9.3,34.01 9.3,25.55 4.38,20.63 4.38,13.14 5.73,11.79 16.64,11.79 18.36,10.06 18.36,8.36 19.23,7.49 22.3,7.49 22.81,8 22.81,12.06 26.64,15.9 48.18,15.9 51.54,12.55 51.54,8.23 51.13,7.82 45.95,7.82 45.49,8.28 PAD21.1
  Top 0.305: PAD21.1 45.49,10.08
KEY_BW
  Top 0.152: JMP_.1 16.51,45.72 18.54,43.69 27.67,43.69 28.43,42.93 R7.1 | S4.1 44.09,48.77 47.12,51.79 53.7,51.79 55.98,49.51 65.13,49.51 66.42,50.8 72.14,50.8 73.35,49.58 73.35,32.94 78.38,27.91 | PAD23.1 40.41,3.99 40.16,3.73 36.25,3.73 36.12,3.61 36.12,1.73 36.65,1.19 36.91,1.19
  Top 0.305: S4.1 30.1,47.75 30.1,43.32 R7.1 | 78.38,27.91 78.38,6.93 72.64,1.19 36.91,1.19 | PAD23.1 40.41,5.13
KEY_BW_LATCHED  (1 unrouted)
  Top 0.152: IC4.5 5.67,55.74 5.42,55.48 2.93,55.48 2.69,55.25 2.69,52.6 4.01,51.28 4.01,45.95 2.92,44.86 2.92,30.42 2.9,30.39 2.9,13.64 6.42,10.12 JMP_8.2 7.27,10.12 | JMP_8.1 9.7,7.31 13.02,3.99 29.67,3.99 32.56,6.88 32.56,10.01 36.58,14.02
  Top 0.305: PAD29.1 42.95,13.18 42.11,14.02 36.58,14.02
KEY_GREEN  (1 unrouted)
  Top 0.152: PAD20.1 37.14,5.38 35.81,4.06 35.81,1.77 35.18,1.14 | 10.92,68.2 9.04,66.32 5.44,66.32 4.17,67.58 JMP_2.2
  Top 0.305: JMP_1.1 35.31,71.37 33.02,73.66 31.24,73.66 S2.1 30.1,72.52 30.1,72.39 30.1,67.69 29.34,66.93 R4.1 28.3,67.45 27.56,68.2 10.92,68.2 | JMP_2.1 1.07,67.22 1.07,2.92 2.84,1.14 35.18,1.14
KEY_GREEN_LATCHED
  Top 0.152: IC4.3 6.03,57.04 4.76,55.77 3.81,55.77 3.81,55.76 2.64,55.76 2.31,55.44 2.31,52.31 3.73,50.89 3.73,46.18 2.56,45.01 2.56,13.39 6.68,9.27 13.97,9.27 17.91,5.33 29.71,5.33 31.7,7.33 31.7,10.86 35.65,14.81 35.66,14.81
  Top 0.305: PAD27.1 48.03,12.8 46.03,14.81 35.66,14.81
KEY_RED  (3 unrouted)
  Top 0.152: 37.85,8.59 38.46,7.98 42.01,7.98 42.52,7.47 54.15,7.47 56.34,9.65 60.45,9.65 60.81,9.3 60.81,6.63 61.85,5.59 61.9,5.59 | JMP14.1 71.85,36.3 71.73,36.3 69.77,34.34 69.77,29.36 | 69.65,27.36 69.99,27.02 JMP17.1 | JMP14.2 74.04,36.71 74.04,36.83
  Top 0.305: S9.1 49.66,74.04 34.93,74.04 33.4,75.56 28.07,75.56 26.16,73.66 18.92,73.66 17.54,72.28 JMP1.1 | S9.1 49.15,72.52 49.15,66.8 48.51,66.17 47.61,66.17 R14.1 | PAD19.1 37.85,9.68 37.85,8.59 | S9.1 53.47,73.53 58.8,68.2 64.98,68.2 65.36,67.82 65.36,65.35 65.21,65.2 55.32,65.2 52.32,62.21 52.32,60.25 53.27,59.3 54.4,59.3 54.95,59.84 54.95,62.45 56.28,63.78 67.91,63.78 72.39,59.3 72.39,57.15 74.04,55.5 74.04,36.83 | 61.9,5.59 69.09,5.59 69.85,6.35 72.9,9.4 72.9,24.11 69.99,27.02
KEY_RED_LATCHED  (2 unrouted)
  Top 0.152: IC3.5 4.68,76.31 3.33,74.95 3.33,67.31 3.81,66.83 JMP12.2 | JMP12.1 3.83,62.48 3.83,57.3 4.01,57.12 JMP13.2 | JMP13.1 4.02,54.64 4.27,54.64 4.27,53.01 6.25,51.03 6.25,43.86 3.23,40.83 3.23,40.67 3.2,40.64 3.2,13.84 5.59,11.46 16.15,11.46 17.68,9.93 17.68,8.1 20.04,5.74 29.44,5.74 31.32,7.62 31.32,11.75 31.29,11.77 31.29,13.13 33.53,15.37 47.75,15.37
  Top 0.305: 50.57,8.81 PAD24.1 50.57,12.55 47.75,15.37
N$1  (1 unrouted)
  Top 0.305: R1.1 58.55,13.48 PAD10.1 | 58.55,12.63
N$2  (1 unrouted)
  Top 0.152: JMP_7.2 10.73,22.28 13.06,22.28 17.21,18.13 46.24,18.13 46.22,18.14 R1.2 | JMP_7.1 8.6,22.15
  Top 0.305: IC1.2 5.69,16.54 5.33,16.89 5.33,19.36 8.2,22.23 | 8.6,22.15 8.36,22.15
N$3  (1 unrouted)
  Top 0.152: 21.59,11.3 PAD18.1 20.09,12.04 20.09,16.88 JMP_4.1 | U1.4 20.04,20.92 JMP_4.2
N$4
  Top 0.152: 13.71,15.89 IC1.12 15.91,15.89 17.91,13.89 17.91,11.81 19.51,10.21 21.59,10.21 22.12,10.21 22.27,10.21 22.48,10.41 22.48,12.66 23.32,13.51 23.34,13.52 26.49,16.68 48.65,16.68 51.94,13.39 51.94,8.19 52.23,7.9 53.95,7.9 56.03,9.98 60.22,9.98 60.68,10.44
  Top 0.305: S1.1 67.94,22.86 67.94,18.56 R2.1 66.41,15.85 65.54,14.99 62.62,14.99 60.68,13.05 60.68,10.44
N$5
  Top 0.305: PAD2.1 R3.1
N$6
  Top 0.152: R3.2 5.21,60.83 4.62,60.25 4.62,58.5 5.43,57.69 IC4.2
N$13  (1 unrouted)
  Top 0.305: R8.1 59.18,36.07 59.69,35.56
N$14
  Top 0.152: 50.36,39.57 25.96,39.57 25.09,40.44 18.16,40.44 17.98,40.62 12.93,40.62 12.8,40.49 6.71,40.49
  Top 0.305: 50.36,39.57 R8.2 | IC2.2 6.68,37.08 5.61,37.08 5.18,37.52 5.18,38.96 6.71,40.49
N$16  (4 unrouted)
  Top 0.152: S6.1 68.96,49.02 54.79,49.02 52.6,51.21 50.8,51.21 50.34,51.21 47.7,51.21 44.6,48.11 37.67,48.11 33.43,43.87 32.59,43.87 29.39,40.67 27.69,40.67 27.61,40.76 27.61,42.9 27.28,43.23 16.41,43.23 14.96,44.68 12.22,44.68 12.24,44.65 JMP11.2 | IC2.12 11.21,36.46 10.57,37.11 10.57,37.67 8.89,39.35 8.89,39.88 | JMP10.2 8.28,42.8 10.16,44.68 | 10.16,44.68 10.44,44.68 | JMP11.1 10.18,44.65 10.16,44.68
  Top 0.305: S6.1 68.2,47.75 68.2,42.94 R9.1
N$17
  Top 0.305: R10.1 58.67,60.96 PAD4.1
N$18
  Top 0.305: JMP3.2 72.79,64.64 55.63,64.64 53.72,62.74 53.72,61.1 R10.2
N$20
  Top 0.305: JMP.2 66.17,78.6 64.5,80.26 19.18,80.26 16.51,77.6 12.61,77.6 IC3.12
N$22
  Top 0.305: R13.1 36.81,36.07 PAD13.1
N$23  (1 unrouted)
  Top 0.152: IC2.6 7.7,34.51 8.43,33.78 8.43,31.71 JMP15.1
  Top 0.305: R13.2 32.84,36.2 30.02,39.01 24.28,39.01 22.61,37.34 22.61,35.31 22.1,34.8 18.92,34.8 15.75,31.62 10.5,31.62 JMP15.2
N$26
  Top 0.305: R15.1 39.62,60.96 PAD6.1
N$27
  Top 0.305: JMP2.2 26.27,65.17 26.8,64.64 31.13,64.64 R15.2
N$30
  Top 0.305: R16.1 PAD8.1
N$31  (1 unrouted)
  Top 0.152: IC4.6 8.01,55.09 11.15,51.94 11.15,50.8 | 11.15,50.8 11.15,50.67 | 11.15,50.8 11.15,43.59 9.86,42.29 9.86,41.02 10.11,40.77 12.34,40.77 12.39,40.77 13.16,41.54 JMP_5.2 | JMP_5.1 13.98,39.54 14.06,39.46
  Top 0.305: R16.2 14.85,37.11 14.85,38.67 14.06,39.46 13.66,39.85 | IC4.6 7.46,55.09
N$33
  Top 0.305: JMP.1 68.09,73.53 S7.1 68.07,72.39 68.07,68.65 R11.1
N$34
  Top 0.305: JMP_.2 16.51,53.34 14.76,55.09 IC4.9
N$35
  Top 0.305: JMP1.2 15.24,74.68 14.25,75.66 IC3.9
N$36
  Top 0.305: IC3.6 5.05,75.66 4.57,75.18 4.57,71.5 7.62,68.45 JMP2.1
N$37
  Top 0.305: JMP3.1 75.17,77.1 70.48,81.79 5.71,81.79 3.94,80.01 3.94,78.61 4.29,78.26 IC3.2
N$39
  Top 0.305: JMP_1.2 35.81,64.02 35.81,58.29 32.51,54.99 25.53,54.99 22.61,57.91 22.61,58.93 21.97,59.56 17.65,59.56 15.13,57.04 IC4.12
REC/PB
  Top 0.152: 74.04,25.15 71.31,27.88 68.39,27.88 64.9,24.38 | PAD32.1 42.95,6.78 43.21,7.04 54.59,7.04 56.87,9.32 60.12,9.32 60.35,9.09 60.35,6.07 61.6,4.83 | U1.2 18.67,21.59 18.95,21.87 18.95,22.73 18.69,22.99 18.69,24.26 18.92,24.49 18.92,26.54 18.67,26.8 18.67,27.96 19.58,28.88 35.79,28.88 S5.1
  Top 0.305: 64.9,24.38 61.09,24.38 58.45,27.03 54.86,27.03 52.45,24.61 41.12,24.61 S5.1 23.04,24.08 21.72,25.4 R6.2 | 74.04,25.15 74.04,8.64 70.23,4.83 61.6,4.83
VCCIO  (4 unrouted)
  Top 0.152: 32.51,41.91 30.58,39.98 27.2,39.98 26.43,40.75 R7.2 25.7,40.92 16.1,40.92 14.22,42.8 12.37,42.8 11.43,41.86 JMP_3.2 | 8.89,17.21 6.74,17.21 | IC1.4 8.1,15.24 8.89,16.03 8.89,17.21 | 9.65,34.29 9.58,34.37 9.58,25.07 9.55,25.07 | 9.53,25.04 9.53,21.13 8.86,20.46 JMP_11.1 8.86,17.25 8.89,17.21 | IC3.4 4.19,76.96 3.05,75.82 3.05,66.55 2.41,65.91 2.41,63.96 2.88,63.49 4.99,63.49 5.07,63.41 | R4.2 25.42,66.04 6.35,66.04 5.08,64.77 5.08,63.42 5.07,63.41 | 16.76,61.85 15.62,62.99 5.49,62.99 5.07,63.41 | IC4.8 11.43,53.28 JMP_3.2 | JMP_3.2 11.43,50.22 | IC2.13 13.71,37.11 14.2,36.63 14.2,36.22 13.77,35.79 12.59,35.79 | 10.87,15.72 10.87,13.89 11.47,13.29 IC1.8 | 10.87,15.72 10.87,16.51 11.55,17.19 IC1.14 | 10.87,15.72 11.43,15.16 12.51,15.16 IC1.11 15.34,15.24 16.79,13.79 16.79,12.34 20.37,8.76 PAD17.1 | IC1.14 12.59,18.96 11.68,19.86 11.03,19.86 JMP_11.2 | 61.77,17.2 59.69,17.2 | 53.34,17.2 24.26,17.2 23.72,17.73 17.04,17.73 16.51,17.2 IC1.14 | 20.29,28.04 19.2,26.95 19.2,23.37 20.02,22.55 U1.5
  Top 0.305: R11.2 52.38,66.85 50.04,64.52 45.85,64.52 45.48,64.88 45.48,65.51 | 45.48,65.51 R14.2 | R4.2 26.3,66.15 26.95,65.51 45.48,65.51 | R2.2 64.25,17.17 61.75,17.17 | 61.75,17.17 61.77,17.2 | R12.2 45.47,41.91 | 45.47,41.91 32.51,41.91 | R9.2 52.96,41.53 51.94,40.51 45.97,40.51 45.47,41.02 45.47,41.91 | IC1.14 12.56,17.21 | IC1.1 6.74,17.21 | IC1.13 IC1.14 | IC1.10 IC1.11 | IC2.13 IC2.14 11.43,38.92 11.43,39.6 | IC2.10 12.59,35.79 IC2.11 10.03,35.81 9.65,36.2 | IC2.1 8.89,37.76 9.65,37 9.65,36.2 | IC2.8 10.08,33.86 9.65,34.29 9.65,36.2 | IC2.4 9.27,35.81 9.65,36.2 | IC4.1 9.65,58.34 | 9.65,58.34 IC4.14 | IC4.13 IC4.14 | IC4.10 IC4.11 10.29,56.39 9.65,57.02 | IC4.8 10.46,54.44 9.65,55.25 9.65,57.02 | 9.65,57.02 9.65,58.34 | IC4.4 9.02,56.39 9.65,57.02 | IC3.1 9.65,78.91 | 9.65,78.91 IC3.14 IC3.13 | IC3.10 IC3.11 10.16,76.96 9.65,77.47 | IC3.4 9.14,76.96 9.65,77.47 | 9.65,77.47 9.65,78.91 | IC3.8 9.95,75.01 9.65,75.31 9.65,77.47 | IC1.14 | 11.43,41.53 11.54,41.53 JMP_3.2 | IC4.14 15.16,58.34 16.76,59.94 16.76,61.85 | 61.75,17.17 60.07,17.17 | 60.07,17.17 59.69,17.55 | 59.69,17.55 56.46,20.78 47.12,20.78 45.21,18.87 29.21,18.87 24.94,18.87 21.57,22.24 U1.5 | 20.29,28.04 23.98,28.04 25.63,26.39 34.01,26.39 S5.2 | PAD22.1 53.11,16.97 53.34,17.2 59.69,17.2 | 59.69,17.55 59.69,17.2 | 59.69,17.2 59.72,17.17 60.07,17.17

### Text on the board
tPlace: BÉCHAMEL | PREPARED / INSTRUMENTS | 2024 | RED | FREQ A | GREEN | B&W | BLUE | FREQ B | REC/PB | FREQ C